# Altium schematic sheet HPF(20Hz).SchDoc
size A; SheetNumber: 4; SheetTotal: 6
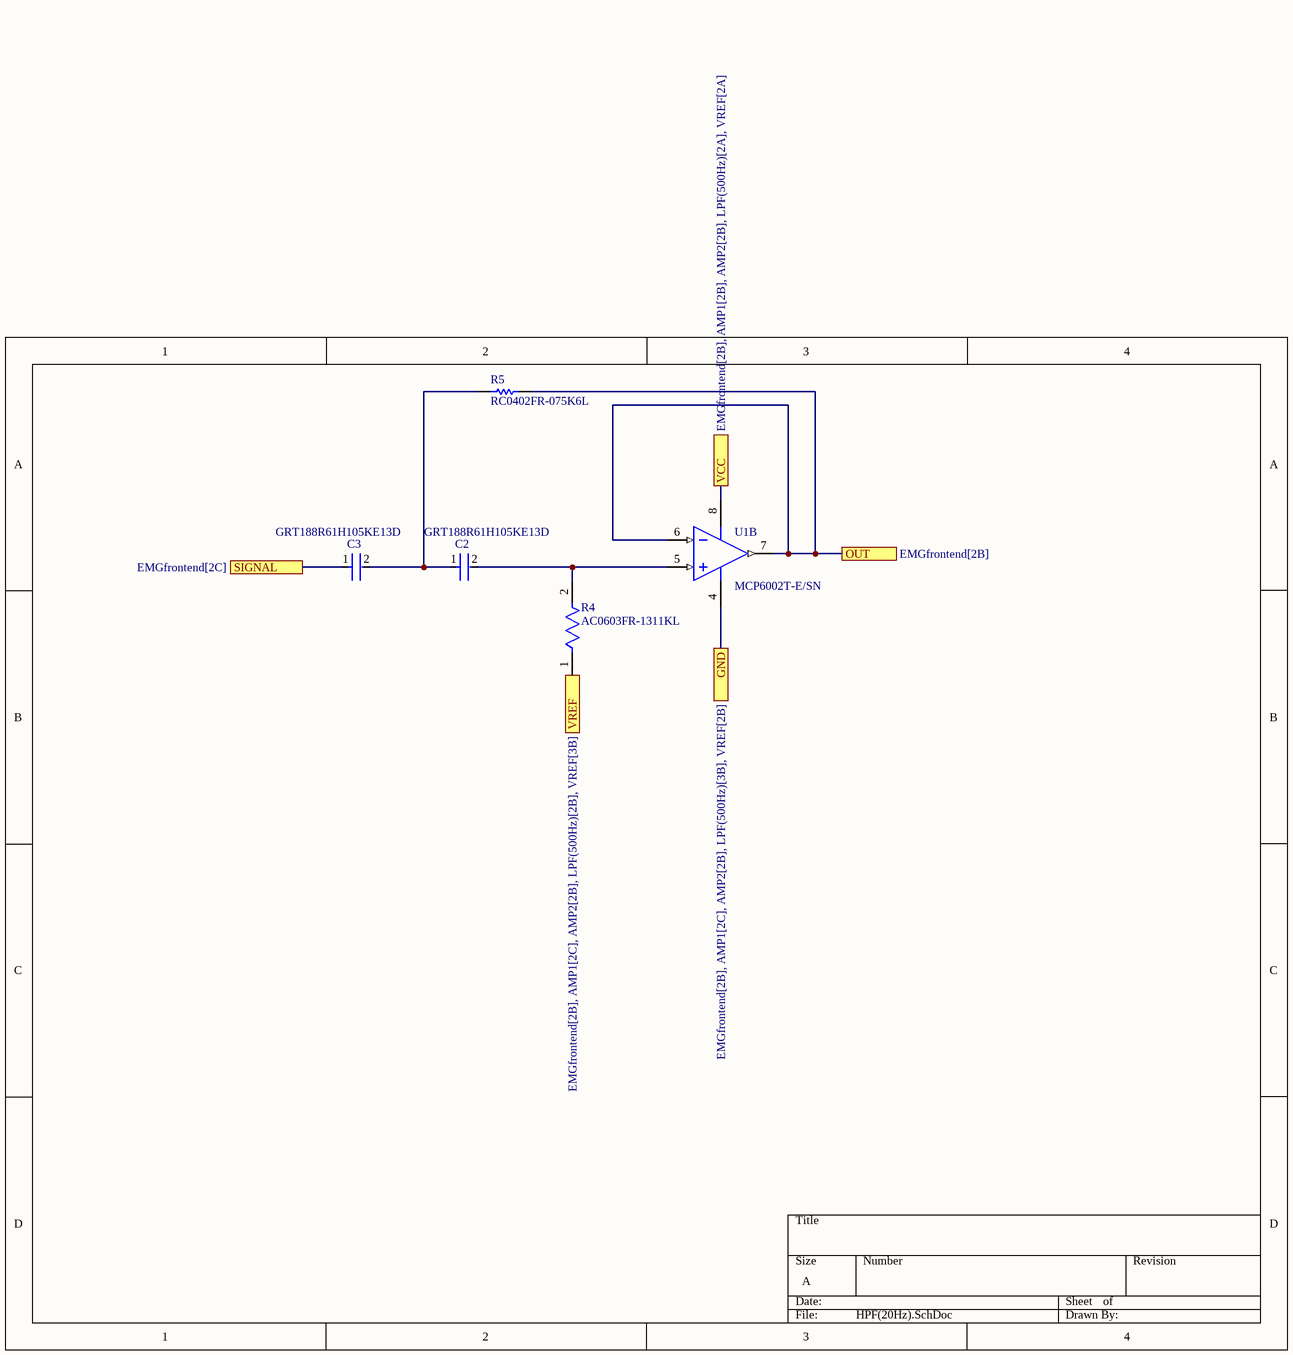
[diagram p0: HPF(20Hz).SchDoc]

## Parts
C2  GRT188R61H105KE13D  [FP-GRT188-0_1-e0_2_0_5-IPC_B]
C3  GRT188R61H105KE13D  [FP-GRT188-0_1-e0_2_0_5-IPC_B]
R4  AC0603FR-1311KL  [FP-AC0603-IPC_B]
R5  RC0402FR-075K6L  [RESC1005X40X25LL05T10]
U1  MCP6002T-E/SN  [SOIC-SN8_N]  (part B of 2)

## Ports
GND (see EMGfrontend[2B], AMP1[2C], AMP2[2B], LPF(500Hz)[3B], VREF[2B]), OUT (see EMGfrontend[2B]), SIGNAL (see EMGfrontend[2C]), VCC (see EMGfrontend[2B], AMP1[2B], AMP2[2B], LPF(500Hz)[2A], VREF[2A]), VREF (see EMGfrontend[2B], AMP1[2C], AMP2[2B], LPF(500Hz)[2B], VREF[3B])

## Nets
GND: U1.4(VSS) ; port GND
OUT: R5.2 U1.6(VINB-) U1.7(VOUTB) ; port OUT
SIGNAL: C3.1 ; port SIGNAL
VCC: U1.8(VDD) ; port VCC
VREF: R4.1 ; port VREF
NetC2_1: C2.1 C3.2 R5.1
NetC2_2: C2.2 R4.2 U1.5(VINB+)

## Library data of the parts
C2 C3 = CMP-06035-031856-1: Multi-Layer Ceramic Capacitor 1uF 50V X5R ±10% 0603 Paper T/R; Voltage Rating (DC): 50V; Voltage Rating: 50V; Min Operating Temperature: -55°C; Case Code (Metric): 1608; Thickness: 0.035inch; Width: 0.031inch; Capacitance: 1uF; Tolerance: 10%; Max Operating Temperature: 85°C; Dielectric: X5R; Case Code (Imperial): 0603; Case/Package: 0603; Length: 0.063inch; Packaging: Tape and Reel; Mount: Surface Mount; Ratings: AEC-Q200
R4 = CMP-03412-047641-1: RES 11KΩ 1.00% 0.1W 0603; RoHS Compliant: Yes
R5 = CMP-2002-07756-1: Manufacturer: Yageo / Phycomp; Part Number: RC0402FR-075K6L
U1 = CMP-0187-00363-3: None; Nominal Supply Current: 100uA; Operating Supply Voltage: 5.5V; Input Bias Current: 1pA; Output Current per Channel: 23mA; Unity Gain Bandwidth Product: 1MHz; Number of Elements: 2; Power Supply Rejection Ratio (PSRR): 86dB; Slew Rate: 0.6V/µs; Min Supply Voltage: 1.8V; Voltage Gain: 112dB; Max Supply Voltage: 6V; Input Offset Voltage (Vos): 4.5mV; Common Mode Rejection Ratio: 60dB; Amplifier Type: GENERAL PURPOSE; Technology: CMOS; Output Current: 23mA; Number of Pins: 8; Lead Free: Lead Free; Number of Channels: 2; Package Quantity: 3300; Max Operating Temperature: 125°C; Number of Circuits: 2; Supply Current: 100uA; Gain Bandwidth Product: 1MHz; Min Operating Temperature: -40°C; Series: -; Mount: Surface Mount; Case/Package: SOIC; Radiation Hardening: No; Packaging: Tape and Reel; Operating Supply Current: 100uA; RoHS Compliant: Yes